# Altium schematic sheet XTF32032768JT003510111_XTF32032768JT00351011.schdoc
size 127 x 101 mm
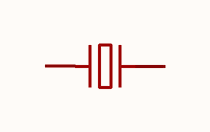
[diagram p0: XTF32032768JT003510111_XTF32032768JT00351011.schdoc]

## Parts
X?  32.768kHz  [CRYSTAL-SMD_L3.2-W1.5-1]  (value not drawn)

## Nets

Not connected (* = marked no-connect by the designer): X? 1 2

## Library data of the parts
X? = XTF32032768JT00351011: Manufacturer: 同晶; Add into BOM: yes; Normal temperature Frequency Tolerance: ±10ppm; Load Capacitance: 12pF; Equivalent Series Resistance(ESR): 70kΩ; Symbol: XTF32032768JT00351011; Device: XTF32032768JT00351011; LCSC Part Name: 32.768KHz 2P 3215 12pF ±10ppm -40~+85℃(-0.04ppm/℃^2); Supplier Part: C37635363; Manufacturer Part: XTF32032768JT00351011; Supplier Footprint: SMD3215-2P; JLCPCB Part Class: Extended Part; Datasheet: https://item.szlcsc.com/datasheet/XTF32032768JT00351011/39361295.html; Supplier: LCSC; Convert to PCB: yes; Type: 贴片晶振; Value: 32.768kHz